# Altium schematic sheet Gigabit Ethernet.SchDoc
size A3; SheetNumber: 9; SheetTotal: 11
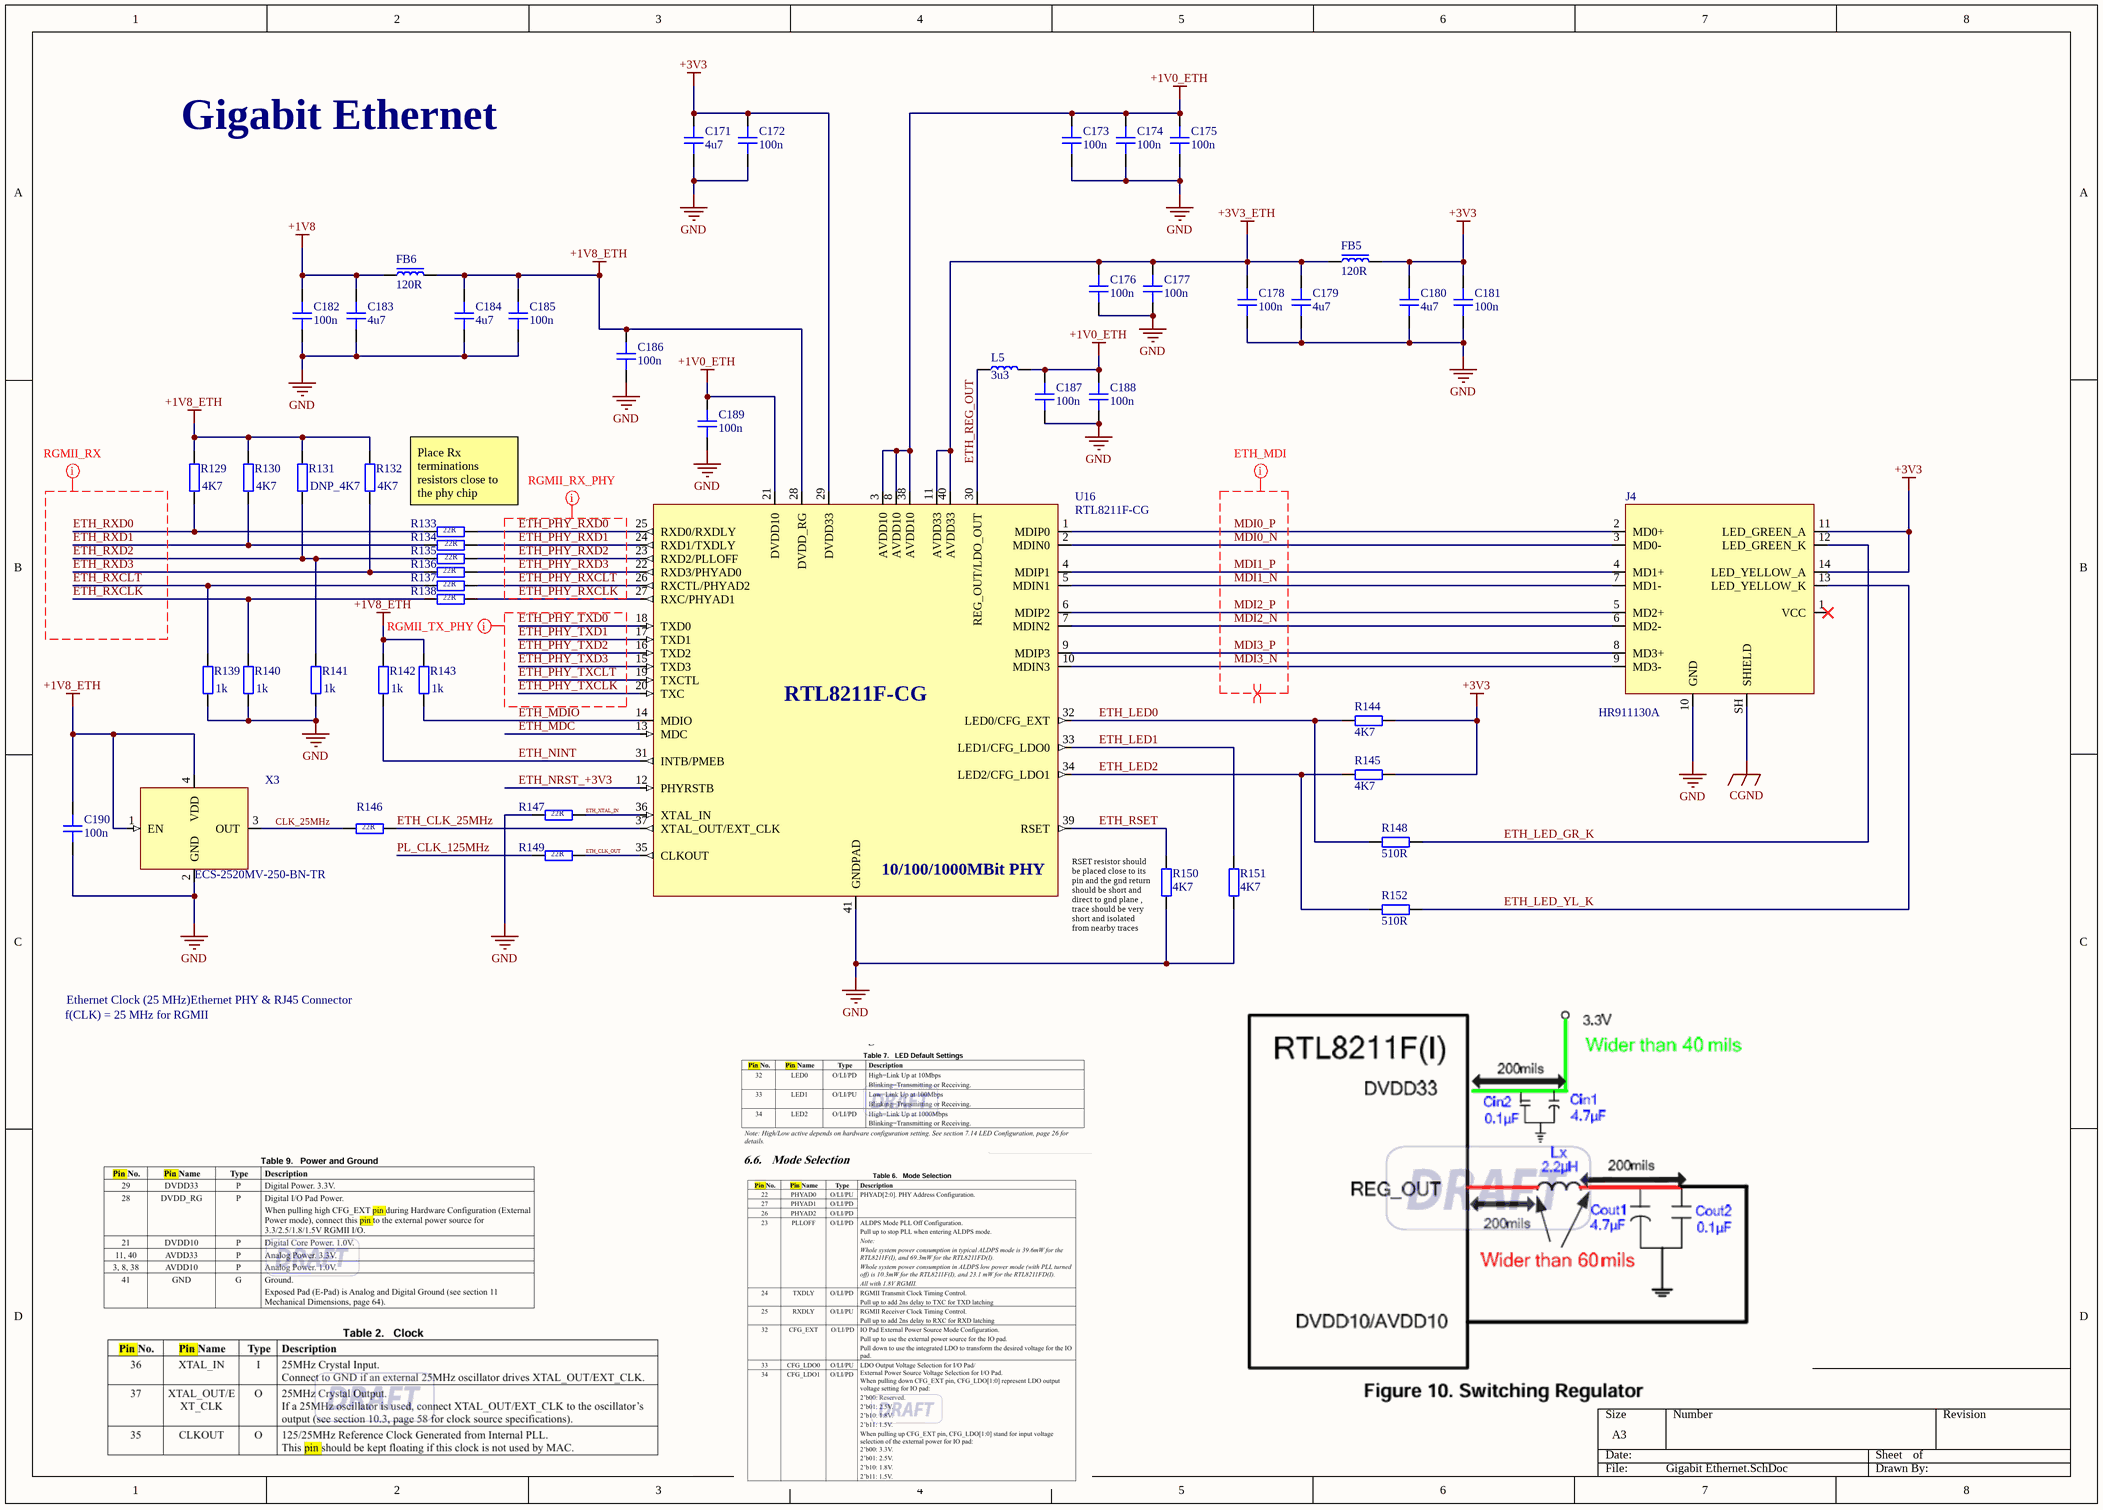
[diagram p0: Gigabit Ethernet.SchDoc]

## Parts
C171  4u7  [CAP_0402]
C172  100n  [CAP_0402]
C173  100n  [CAP_0402]
C174  100n  [CAP_0402]
C175  100n  [CAP_0402]
C176  100n  [CAP_0402]
C177  100n  [CAP_0402]
C178  100n  [CAP_0402]
C179  4u7  [CAP_0402]
C180  4u7  [CAP_0402]
C181  100n  [CAP_0402]
C182  100n  [CAP_0402]
C183  4u7  [CAP_0402]
C184  4u7  [CAP_0402]
C185  100n  [CAP_0402]
C186  100n  [CAP_0402]
C187  100n  [CAP_0402]
C188  100n  [CAP_0402]
C189  100n  [CAP_0402]
C190  100n  [CAP_0402]
FB5  120R  [FB_0402]
FB6  120R  [FB_0402]
J4  HR911130A  [HR911130A]
L5  value 3u3  [IND_0402]  (hidden comment: L0402)
R129  value 4K7  [RES_0402]  (hidden comment: R0402)
R130  value 4K7  [RES_0402]  (hidden comment: R0402)
R131  value DNP_4K7  [RES_0402]  (hidden comment: R0402)
R132  value 4K7  [RES_0402]  (hidden comment: R0402)
R133  value 22R  [RES_0402]  (hidden comment: R0402)
R134  value 22R  [RES_0402]  (hidden comment: R0402)
R135  value 22R  [RES_0402]  (hidden comment: R0402)
R136  value 22R  [RES_0402]  (hidden comment: R0402)
R137  value 22R  [RES_0402]  (hidden comment: R0402)
R138  value 22R  [RES_0402]  (hidden comment: R0402)
R139  value 1k  [RES_0402]  (hidden comment: R0402)
R140  value 1k  [RES_0402]  (hidden comment: R0402)
R141  value 1k  [RES_0402]  (hidden comment: R0402)
R142  value 1k  [RES_0402]  (hidden comment: R0402)
R143  value 1k  [RES_0402]  (hidden comment: R0402)
R144  value 4K7  [RES_0402]  (hidden comment: R0402)
R145  value 4K7  [RES_0402]  (hidden comment: R0402)
R146  value 22R  [RES_0402]  (hidden comment: R0402)
R147  value 22R  [RES_0402]  (hidden comment: R0402)
R148  value 510R  [RES_0402]  (hidden comment: R0402)
R149  value 22R  [RES_0402]  (hidden comment: R0402)
R150  value 4K7  [RES_0402]  (hidden comment: R0402)
R151  value 4K7  [RES_0402]  (hidden comment: R0402)
R152  value 510R  [RES_0402]  (hidden comment: R0402)
U16  RTL8211F-CG  [QFN-40-0.4-EP]
X3  ECS-2520MV-250-BN-TR  [XTAL_2520]

## Nets
+1V0_ETH: C173.2 C174.2 C175.2 C187.2 C188.2 C189.2 L5.2 U16.3(AVDD10) U16.8(AVDD10) U16.21(DVDD10) U16.38(AVDD10)
+1V8: C182.2 C183.2 FB6.1
+1V8_ETH: C184.2 C185.2 C186.2 C190.2 FB6.2 R129.2 R130.2 R131.2 R132.2 R142.2 R143.2 U16.28(DVDD_RG) X3.1(EN) X3.4(VDD)
+3V3: C171.2 C172.2 C180.2 C181.2 FB5.1 J4.11(LED_GREEN_A) J4.14(LED_YELLOW_A) R144.1 R145.1 U16.29(DVDD33)
+3V3_ETH: C176.2 C177.2 C178.2 C179.2 FB5.2 U16.11(AVDD33) U16.40(AVDD33)
CGND: J4.SH(SHIELD)
GND: C171.1 C172.1 C173.1 C174.1 C175.1 C176.1 C177.1 C178.1 C179.1 C180.1 C181.1 C182.1 C183.1 C184.1 C185.1 C186.1 C187.1 C188.1 C189.1 C190.1 J4.10(GND) R139.1 R140.1 R141.1 R147.2 R150.2 R151.2 U16.41(GNDPAD) X3.2(GND)
CLK_25MHz: R146.2 X3.3(OUT)
ETH_CLK_25MHz: R146.1 U16.37(XTAL_OUT/EXT_CLK)
ETH_CLK_OUT: R149.1 U16.35(CLKOUT)
ETH_LED0: R144.2 R148.2 U16.32(LED0/CFG_EXT)
ETH_LED1: R151.1 U16.33(LED1/CFG_LDO0)
ETH_LED2: R145.2 R152.2 U16.34(LED2/CFG_LDO1)
ETH_LED_GR_K: J4.12(LED_GREEN_K) R148.1
ETH_LED_YL_K: J4.13(LED_YELLOW_K) R152.1
ETH_MDC: U16.13(MDC)
ETH_MDIO: R143.1 U16.14(MDIO)
ETH_NINT: R142.1 U16.31(INTB/PMEB)
ETH_NRST_+3V3: U16.12(PHYRSTB)
ETH_PHY_RXCLK: R138.1 U16.27(RXC/PHYAD1)
ETH_PHY_RXCLT: R137.1 U16.26(RXCTL/PHYAD2)
ETH_PHY_RXD0: R133.1 U16.25(RXD0/RXDLY)
ETH_PHY_RXD1: R134.1 U16.24(RXD1/TXDLY)
ETH_PHY_RXD2: R135.1 U16.23(RXD2/PLLOFF)
ETH_PHY_RXD3: R136.1 U16.22(RXD3/PHYAD0)
ETH_PHY_TXCLK: U16.20(TXC)
ETH_PHY_TXCLT: U16.19(TXCTL)
ETH_PHY_TXD0: U16.18(TXD0)
ETH_PHY_TXD1: U16.17(TXD1)
ETH_PHY_TXD2: U16.16(TXD2)
ETH_PHY_TXD3: U16.15(TXD3)
ETH_REG_OUT: L5.1 U16.30(REG_OUT/LDO_OUT)
ETH_RSET: R150.1 U16.39(RSET)
ETH_RXCLK: R138.2 R140.2
ETH_RXCLT: R137.2 R139.2
ETH_RXD0: R129.1 R133.2
ETH_RXD1: R130.1 R134.2
ETH_RXD2: R131.1 R135.2 R141.2
ETH_RXD3: R132.1 R136.2
ETH_XTAL_IN: R147.1 U16.36(XTAL_IN)
MDI0_N: J4.3(MD0-) U16.2(MDIN0)
MDI0_P: J4.2(MD0+) U16.1(MDIP0)
MDI1_N: J4.7(MD1-) U16.5(MDIN1)
MDI1_P: J4.4(MD1+) U16.4(MDIP1)
MDI2_N: J4.6(MD2-) U16.7(MDIN2)
MDI2_P: J4.5(MD2+) U16.6(MDIP2)
MDI3_N: J4.9(MD3-) U16.10(MDIN3)
MDI3_P: J4.8(MD3+) U16.9(MDIP3)
PL_CLK_125MHz: R149.2

Not connected (* = marked no-connect by the designer): J4 1(VCC)*

## Layout directives
differential pair; differential pair class 100ohm: MDI0_N, MDI0_P, MDI1_N, MDI1_P, MDI2_N, MDI2_P, MDI3_N, MDI3_P
net class ETH_MDI: MDI0_N, MDI0_P, MDI1_N, MDI1_P, MDI2_N, MDI2_P, MDI3_N, MDI3_P
net class RGMII_RX; rule Matched Net Lengths [Delay Tolerance = 20ps]: ETH_RXCLK, ETH_RXCLT, ETH_RXD0, ETH_RXD1, ETH_RXD2, ETH_RXD3
net class RGMII_TX_PHY; rule Matched Net Lengths [Delay Tolerance = 20ps]: ETH_PHY_TXCLK, ETH_PHY_TXCLT, ETH_PHY_TXD0, ETH_PHY_TXD1, ETH_PHY_TXD2, ETH_PHY_TXD3
net class RGMII_RX_PHY; rule Matched Net Lengths [Delay Tolerance = 20ps]: ETH_PHY_RXCLK, ETH_PHY_RXCLT, ETH_PHY_RXD0, ETH_PHY_RXD1, ETH_PHY_RXD2, ETH_PHY_RXD3

## Notes on the sheet
- Gigabit Ethernet
- Place Rx terminations resistors close to the phy chip
- RSET resistor should be placed close to its pin and the gnd return should be short and direct to gnd plane , trace should be very short and isolated from nearby traces
- f(CLK) = 25 MHz for RGMII
- Ethernet Clock (25 MHz)Ethernet PHY & RJ45 Connector
- (in symbol RTL8211F-CG) 10/100/1000MBit PHY

## Library data of the parts
C171-C190 = CAP_0402: Capacitor SMD 0402; Manufacturer: *; Manufacturer Part Number: *; Distributor Link: *; LCSC: *; Rating: *; Dielectric: *; package: 0402
FB5 FB6 = FB_0402: Ferrite Bead SMD 0402; Manufacturer: *; Manufacturer Part Number: *; Distributor Link: *; LCSC: *
J4 = HR911130A: 100/1000Base-T Magnetics Single-Port RJ45 Connector with Integrated Magnetics and LEDs; Manufacturer: Hanrun; Manufacturer Part Number: HR911130A
L5 = IND_0402: Inductor SMD 0402
R129-R152 = RES_0402: Resistor SMD 0402; Manufacturer: *; Manufacturer Part Number: *; Distributor Link: *; LCSC: *
U16 = RTL8211F-CG: INTEGRATED 10/100/1000M ETHERNET PRECISION TRANSCEIVER; Manufacturer: Realtek; Manufacturer Part Number: RTL8211F-CG
X3 = ECS-2520MV-130-BN-TR: Standard Clock Oscillators XO (Standard),13MHz,Standby (Power Down),CMOS, Multi-Volt,1.6 V 3.6 V,+/-50ppm,-40 C 85 C,6mA,Surface Mount,4-SMD, No Lead,(2.50mm x 2.00mm),(0.80mm); Manufacturer: ECS; Manufacturer Part Number: ECS-2520MV-130-BN-TR